# Altium project kursova.PrjPcb
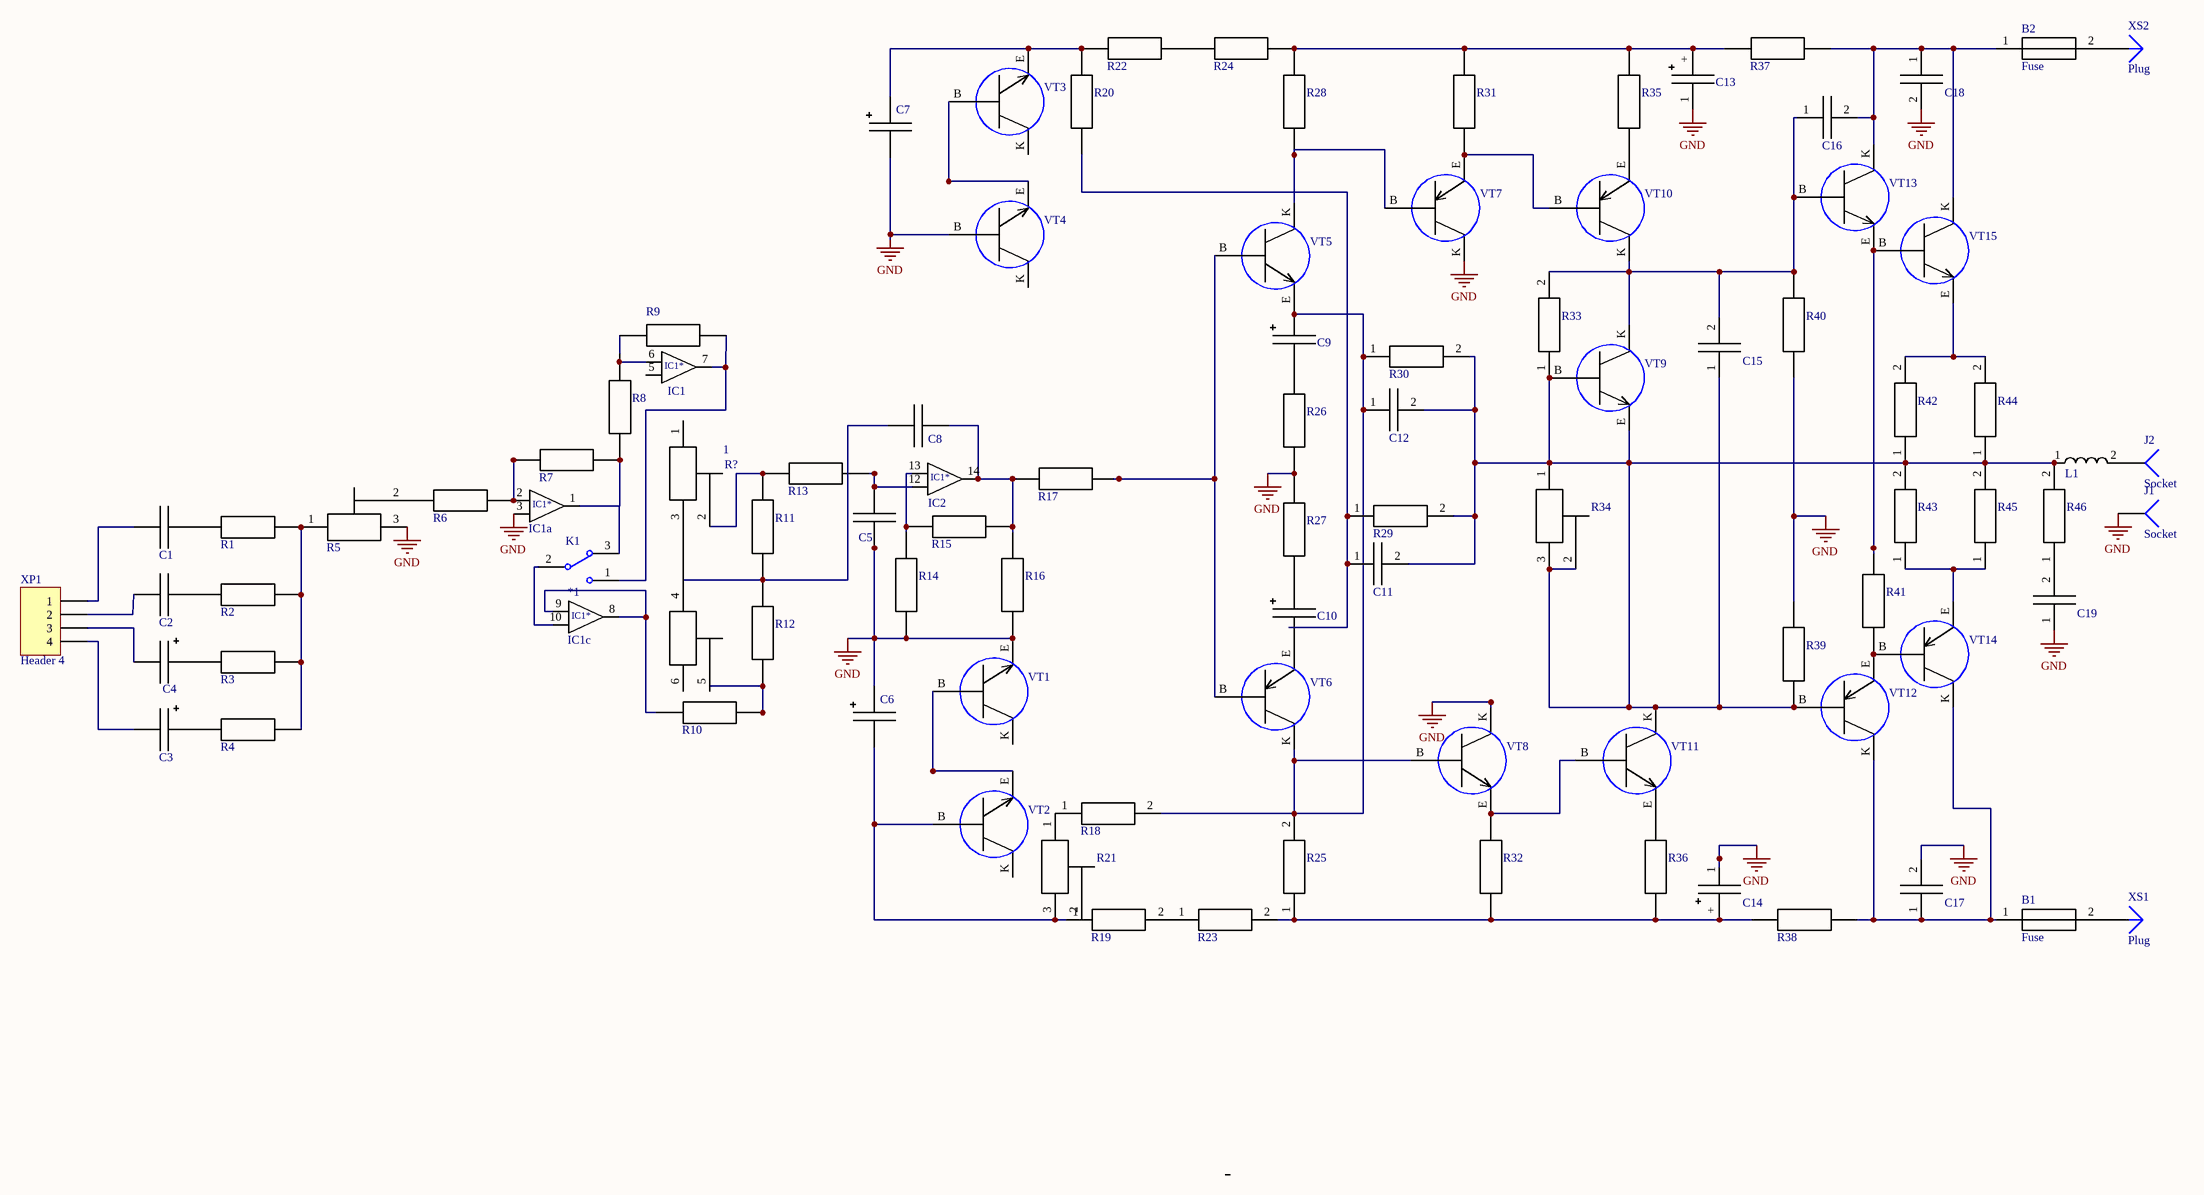
[diagram p0: EP.SchDoc]
1 sheet, 94 parts. Net scope: global (net labels, ports and power ports of the same name join across sheets).
Board file: PCB1.PcbDoc

## Sheet EP.SchDoc
size A1

### Parts
1  R?  [Pidresistor]
*1  IC1c  [DIP8]
B1  Fuse
B2  Fuse
C1  Capacitor  [Capacitor]  (value not drawn)
C2  Capacitor  [Capacitor]  (value not drawn)
C3  Capacitor (+)  [Capacitor (+) 2.5]  (value not drawn)
C4  Capacitor (+)  [Capacitor (+) 2.5]  (value not drawn)
C5  Capacitor  [Capacitor]  (value not drawn)
C6  Capacitor (+)  [Capacitor (+) 2.5]  (value not drawn)
C7  Capacitor (+)  [Capacitor (+) 2.5]  (value not drawn)
C8  Capacitor  [Capacitor]  (value not drawn)
C9  Capacitor (+)  [Capacitor (+) 2.5]  (value not drawn)
C10  Capacitor (+)  [Capacitor (+) 2.5]  (value not drawn)
C11  Capacitor  [Capacitor]  (value not drawn)
C12  Capacitor  [Capacitor]  (value not drawn)
C13  Capacitor (+)  [Capacitor (+) 2.5]  (value not drawn)
C14  Capacitor (+)  [Capacitor (+) 2.5]  (value not drawn)
C15  Capacitor  [Capacitor]  (value not drawn)
C16  Capacitor  [Capacitor]  (value not drawn)
C17  Capacitor  [Capacitor]  (value not drawn)
C18  Capacitor  [Capacitor]  (value not drawn)
C19  Capacitor  [Capacitor]  (value not drawn)
IC1  TL084  [DIP8]  (value not drawn)
IC1a  IC1a  [DIP8]  (graphical)
IC2  IC1d  [DIP8]  (value not drawn)
J1  Socket  [PIN1]
J2  Socket  [PIN1]
K1  K  [TL36WW15050]  (value not drawn)
L1  Drosel  [Drosel]  (value not drawn)
R1  Resistor  [Resistor]  (value not drawn)
R2  Resistor  [Resistor]  (value not drawn)
R3  Resistor  [Resistor]  (value not drawn)
R4  Resistor  [Resistor]  (value not drawn)
R5  Pidresistor  [Pidrest_2]  (value not drawn)
R6  Resistor  [Resistor]  (value not drawn)
R7  Resistor  [Resistor]  (value not drawn)
R8  Resistor  [Resistor]  (value not drawn)
R9  Resistor  [Resistor]  (value not drawn)
R10  Resistor  [Resistor]  (value not drawn)
R11  Resistor  [Resistor]  (value not drawn)
R12  Resistor  [Resistor]  (value not drawn)
R13  Resistor  [Resistor]  (value not drawn)
R14  Resistor  [Resistor]  (value not drawn)
R15  Resistor  [Resistor]  (value not drawn)
R16  Resistor  [Resistor]  (value not drawn)
R17  Resistor  [Resistor]  (value not drawn)
R18  Resistor  [Resistor]  (value not drawn)
R19  Resistor  [Resistor]  (value not drawn)
R20  Resistor  [Resistor]  (value not drawn)
R21  Pidresistor  [Pidresistor]  (value not drawn)
R22  Resistor  [Resistor]  (value not drawn)
R23  Resistor  [Resistor]  (value not drawn)
R24  Resistor  [Resistor]  (value not drawn)
R25  Resistor  [Resistor]  (value not drawn)
R26  Resistor  [Resistor]  (value not drawn)
R27  Resistor  [Resistor]  (value not drawn)
R28  Resistor  [Resistor]  (value not drawn)
R29  Resistor  [Resistor]  (value not drawn)
R30  Resistor  [Resistor]  (value not drawn)
R31  Resistor  [Resistor]  (value not drawn)
R32  Resistor  [Resistor]  (value not drawn)
R33  Resistor  [Resistor]  (value not drawn)
R34  Pidresistor  [Pidresistor]  (value not drawn)
R35  Resistor  [Resistor]  (value not drawn)
R36  Resistor  [Resistor]  (value not drawn)
R37  Resistor  [Resistor]  (value not drawn)
R38  Resistor  [Resistor]  (value not drawn)
R39  Resistor  [Resistor]  (value not drawn)
R40  Resistor  [Resistor]  (value not drawn)
R41  Resistor  [Resistor]  (value not drawn)
R42  Resistor 1 Wt  [Resistor 1 Wt]  (value not drawn)
R43  Resistor 1 Wt  [Resistor 1 Wt]  (value not drawn)
R44  Resistor 1 Wt  [Resistor 1 Wt]  (value not drawn)
R45  Resistor 1 Wt  [Resistor 1 Wt]  (value not drawn)
R46  Resistor 1 Wt  [Resistor 1 Wt]  (value not drawn)
VT1  쫓238;639;  [TO-92]  (value not drawn)
VT2  쫓238;639;  [TO-92]  (value not drawn)
VT3  쫓238;639;  [TO-92]  (value not drawn)
VT4  쫓238;639;  [TO-92]  (value not drawn)
VT5  쫓238;639;  [TO-92]  (value not drawn)
VT6  쫓640  [TO-92]  (value not drawn)
VT7  쫓640  [TO-92]  (value not drawn)
VT8  쫓238;639;  [TO-92]  (value not drawn)
VT9  MJE340  [TO-126(TO-225)]  (value not drawn)
VT10  MJE350  [TO-126(TO-225)]  (value not drawn)
VT11  BD137  [TO-126(TO-225)]  (value not drawn)
VT12  BD242C  [TO-220]  (value not drawn)
VT13  BD241C  [TO-220]  (value not drawn)
VT14  BD250C  [TO-220]  (value not drawn)
VT15  BD249C  [SOT-93]  (value not drawn)
XP1  Header 4  [HDR1X4]
XS1  Plug  [PIN1]
XS2  Plug  [PIN1]

### Nets
GND: C5.2 C6.+ C7.1 C13.1 C14.1 C17.2 C18.2 C19.1 IC1a.3 J1.1 R5.3 R14.2 R16.2 R26.2 R27.1 R39.1 R40.2 VT1.E VT4.B VT7.K VT8.K
Net1_2: 1.2 R11.1 R13.1
Net*1_8: *1.8 *1.9 R10.1
Net*1_10: *1.10 K1.2
NetB1_1: B1.1 C17.1 R38.1 VT12.K VT14.K
NetB1_2: B1.2 XS1.1
NetB2_1: B2.1 C16.2 C18.1 R37.1 VT13.K VT15.K
NetB2_2: B2.2 XS2.1
NetC1_1: C1.1 XP1.1
NetC1_2: C1.2 R1.1
NetC2_1: C2.1 XP1.2
NetC2_2: C2.2 R2.1
NetC3_1: C3.1 XP1.4
NetC3_+: C3.+ R4.1
NetC4_1: C4.1 XP1.3
NetC4_+: C4.+ R3.1
NetC5_1: C5.1 IC2.12 R13.2
NetC6_1: C6.1 VT2.B
NetC7_+: C7.+ R20.2 R22.1 VT3.E
NetC8_1: C8.1 R11.2 R12.1
NetC8_2: C8.2 IC2.14 R15.2 R16.1 R17.1
NetC9_+: C9.+ VT5.E
NetC10_1: C10.1 VT6.E
NetC10_+: C10.+ R27.2
NetC11_1: C11.1 R20.1 R29.1
NetC11_2: C11.2 C12.2 C15.1 L1.1 R29.2 R30.2 R33.1 R34.1 R34.2 R34.3 R39.2 R42.1 R43.2 R44.1 R45.2 R46.2 VT9.B VT9.E VT11.K VT12.B
NetC12_1: C12.1 R18.2 R25.2 R30.1 VT6.K VT8.B
NetC13_+: C13.+ R24.2 R28.1 R31.1 R35.1 R37.2
NetC14_+: C14.+ R23.2 R25.1 R32.1 R36.1 R38.2
NetC15_2: C15.2 C16.1 R33.2 R40.1 VT9.K VT10.K VT13.B
NetC19_2: C19.2 R46.1
NetIC1_7: IC1.7 K1.1 R9.2
NetIC1a_1: IC1a.1 K1.3
NetIC1a_2: IC1a.2 R6.2 R7.1
NetIC2_13: IC2.13 R14.1 R15.1
NetJ2_1: J2.1 L1.2
NetR1_2: R1.2 R2.2 R3.2 R4.2 R5.1
NetR5_2: R5.2 R6.1
NetR7_2: R7.2 R8.2
NetR8_1: R8.1 R9.1
NetR10_2: R10.2 R12.2
NetR17_2: R17.2 VT5.B VT6.B
NetR18_1: R18.1 R21.1
NetR19_1: R19.1 R21.3
NetR19_2: R19.2 R23.1
NetR22_2: R22.2 R24.1
NetR28_2: R28.2 VT5.K VT7.B
NetR31_2: R31.2 VT7.E VT10.B
NetR32_2: R32.2 VT8.E VT11.B
NetR35_2: R35.2 VT10.E
NetR36_2: R36.2 VT11.E
NetR41_1: R41.1 VT13.E VT15.B
NetR41_2: R41.2 VT12.E VT14.B
NetR42_2: R42.2 R44.2 VT15.E
NetR43_1: R43.1 R45.1 VT14.E
NetVT1_B: VT1.B VT2.E
NetVT3_B: VT3.B VT4.E

Not connected (* = marked no-connect by the designer): 1 1 3 4 5 6; C9 1; IC1 5 6; R21 2; R26 1; VT1 K; VT2 K; VT3 K; VT4 K

### Notes on the sheet
- (in symbol TL084) IC1*

### Library data of the parts
1 = Pidres_2
*1 IC1a IC2 = TL084
K1 = SW-SPDT: SPDT Subminiature Toggle Switch, Right Angle Mounting, Vertical Actuation; Published: 24-Mar-1999; LatestRevisionDate: 17-Dec-2003; LatestRevisionNote: Schematic revised, PCB Footprint replaced.; DatasheetVersion: 05-Dec-2000; PackageReference: TL36WW15050; Publisher: Altium Limited; PackageDescription: Switch; 4 Leads; ComponentLink1Description: Manufacturer Link; ComponentLink1URL: http://www.apem.com
XP1 = Header 4: Header, 4-Pin; LatestRevisionDate: 17-Jul-2002; LatestRevisionNote: Re-released for DXP Platform.; Publisher: Altium Limited
J1 J2 = Socket: LatestRevisionDate: 17-Jul-2002; LatestRevisionNote: Re-released for DXP Platform.; Publisher: Altium Limited
XS1 XS2 = Plug: LatestRevisionDate: 17-Jul-2002; LatestRevisionNote: Re-released for DXP Platform.; Publisher: Altium Limited